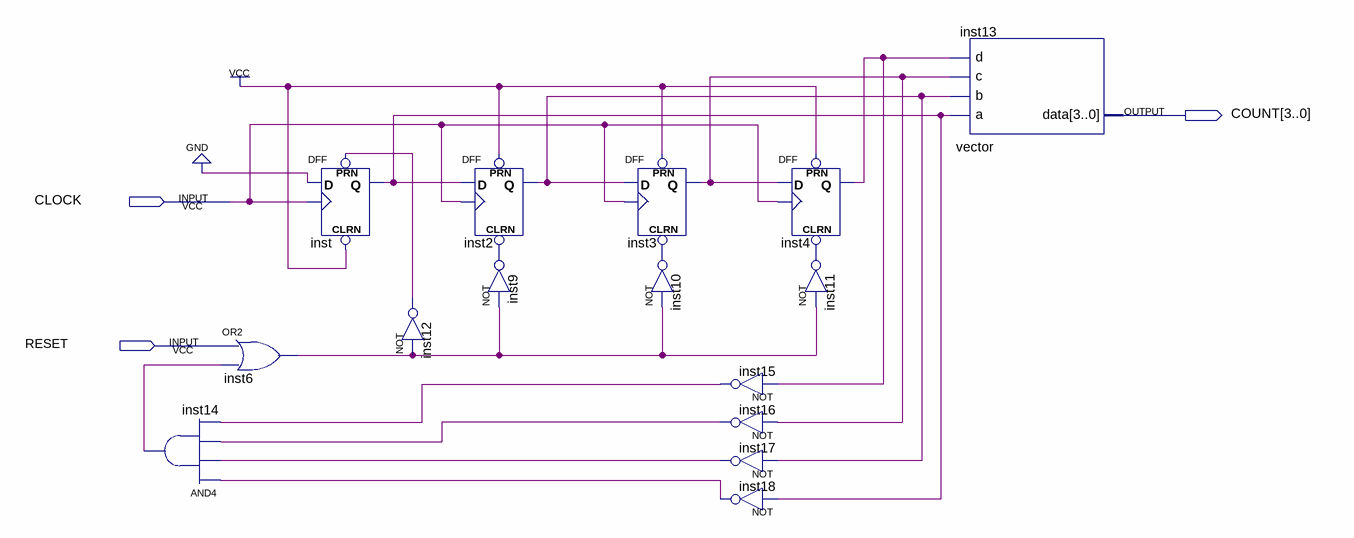
[diagram p0: schematic sheet]
// Quartus schematic Exp83.bdf as structural Verilog: 15 symbols, 3 pins
module Exp83 (
  input  CLOCK,
  input  RESET,
  output [3:0] COUNT
);

  wire inst2_q, inst3_q, inst4_q, inst6_out, inst9_out, inst10_out, inst11_out, inst12_out, inst14_out,
       inst15_out, inst16_out, inst17_out, inst18_out, inst_q;

  and inst14 (inst14_out, inst18_out, inst17_out, inst16_out, inst15_out);
  or inst6 (inst6_out, RESET, inst14_out);
  DFF inst (.CLRN(1'b1), .CLK(CLOCK), .D(1'b0), .PRN(inst12_out), .Q(inst_q));
  not inst12 (inst12_out, inst6_out);
  DFF inst2 (.CLRN(inst9_out), .CLK(CLOCK), .D(inst_q), .PRN(1'b1), .Q(inst2_q));
  not inst9 (inst9_out, inst6_out);
  DFF inst3 (.CLRN(inst10_out), .CLK(CLOCK), .D(inst2_q), .PRN(1'b1), .Q(inst3_q));
  not inst10 (inst10_out, inst6_out);
  DFF inst4 (.CLRN(inst11_out), .CLK(CLOCK), .D(inst3_q), .PRN(1'b1), .Q(inst4_q));
  not inst15 (inst15_out, inst4_q);
  not inst16 (inst16_out, inst3_q);
  not inst17 (inst17_out, inst2_q);
  not inst18 (inst18_out, inst_q);
  not inst11 (inst11_out, inst6_out);
  vector inst13 (.a(inst_q), .b(inst2_q), .c(inst3_q), .d(inst4_q), .data(COUNT));
endmodule
